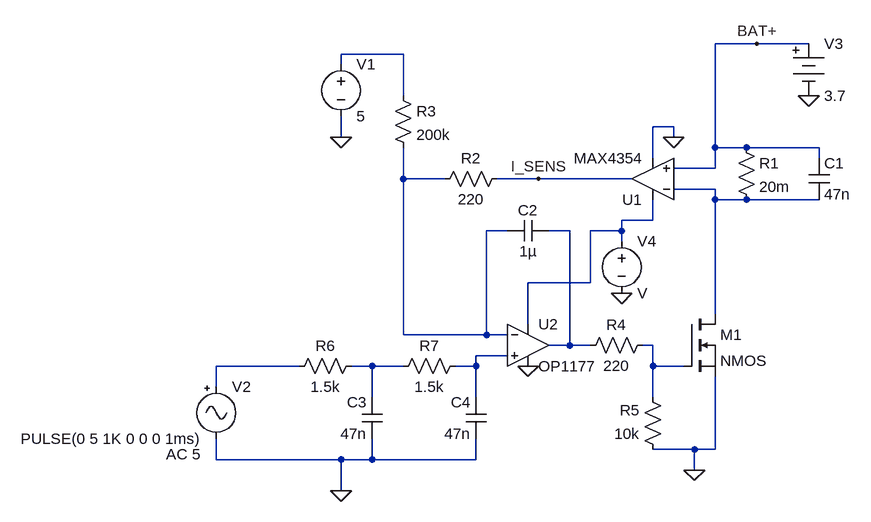
[diagram p0: schematic CurrentSetCircuit.asc]
CurrentSetCircuit.asc, the LTspice schematic file:
Version 4
SHEET 1 880 680
WIRE 208 -32 144 -32
WIRE 288 -32 208 -32
WIRE -336 -16 -432 -16
WIRE -432 0 -432 -16
WIRE -336 48 -336 -16
WIRE 80 96 48 96
WIRE -432 112 -432 80
WIRE 80 112 80 96
WIRE 144 128 144 -32
WIRE 192 128 144 128
WIRE 304 128 192 128
WIRE 48 144 48 96
WIRE 304 144 304 128
WIRE 144 160 144 128
WIRE 144 160 80 160
WIRE -336 176 -336 128
WIRE -272 176 -336 176
WIRE -128 176 -192 176
WIRE 16 176 -128 176
WIRE 144 192 80 192
WIRE 144 208 144 192
WIRE 192 208 144 208
WIRE 304 208 192 208
WIRE 48 240 48 208
WIRE 48 240 0 240
WIRE -176 256 -208 256
WIRE -80 256 -112 256
WIRE 0 256 0 240
WIRE 0 256 -48 256
WIRE 0 272 0 256
WIRE -48 336 -48 256
WIRE -48 336 -144 336
WIRE 144 384 144 208
WIRE -144 400 -144 336
WIRE -336 416 -336 176
WIRE -208 416 -208 256
WIRE -208 416 -336 416
WIRE -176 416 -208 416
WIRE -80 432 -80 256
WIRE -80 432 -112 432
WIRE -48 432 -80 432
WIRE 48 432 32 432
WIRE -176 448 -224 448
WIRE -496 464 -624 464
WIRE -384 464 -416 464
WIRE -336 464 -384 464
WIRE -224 464 -224 448
WIRE -224 464 -256 464
WIRE 48 464 48 432
WIRE 96 464 48 464
WIRE -624 496 -624 464
WIRE -384 512 -384 464
WIRE -224 512 -224 464
WIRE 48 512 48 464
WIRE 112 592 48 592
WIRE 144 592 144 480
WIRE 144 592 112 592
WIRE -624 608 -624 576
WIRE -432 608 -624 608
WIRE -384 608 -384 576
WIRE -384 608 -432 608
WIRE -224 608 -224 576
WIRE -224 608 -384 608
WIRE 112 624 112 592
WIRE -432 656 -432 608
FLAG -432 112 0
FLAG 112 624 0
FLAG -432 656 0
FLAG 288 48 0
FLAG 80 112 0
FLAG -144 464 0
FLAG 0 352 0
FLAG -128 176 I_SENS
FLAG 208 -32 BAT+
SYMBOL res 176 112 R0
SYMATTR InstName R1
SYMATTR Value 20m
SYMBOL cap 288 144 R0
SYMATTR InstName C1
SYMATTR Value 47n
SYMBOL OpAmps\\MAX4354 48 240 R180
SYMATTR InstName U1
SYMBOL res -176 160 R90
WINDOW 0 0 56 VBottom 2
WINDOW 3 32 56 VTop 2
SYMATTR InstName R2
SYMATTR Value 220
SYMBOL res -352 32 R0
SYMATTR InstName R3
SYMATTR Value 200k
SYMBOL nmos 96 384 R0
SYMATTR InstName M1
SYMBOL OpAmps\\OP1177 -144 368 R0
SYMATTR InstName U2
SYMBOL cap -112 240 R90
WINDOW 0 0 32 VBottom 2
WINDOW 3 32 32 VTop 2
SYMATTR InstName C2
SYMATTR Value 1µ
SYMBOL voltage -432 -16 R0
WINDOW 123 0 0 Left 0
WINDOW 39 0 0 Left 0
SYMATTR InstName V1
SYMATTR Value 5
SYMBOL res 48 416 R90
WINDOW 0 0 56 VBottom 2
WINDOW 3 32 56 VTop 2
SYMATTR InstName R4
SYMATTR Value 220
SYMBOL res 64 608 R180
WINDOW 0 36 76 Left 2
WINDOW 3 36 40 Left 2
SYMATTR InstName R5
SYMATTR Value 10k
SYMBOL Misc\\signal -624 480 R0
WINDOW 3 -301 96 Left 2
WINDOW 123 -77 120 Left 2
WINDOW 39 0 0 Left 0
SYMATTR InstName V2
SYMATTR Value PULSE(0 5 1K 0 0 0 1ms)
SYMATTR Value2 AC 5
SYMBOL res -400 448 R90
WINDOW 0 0 56 VBottom 2
WINDOW 3 32 56 VTop 2
SYMATTR InstName R6
SYMATTR Value 1.5k
SYMBOL res -240 448 R90
WINDOW 0 0 56 VBottom 2
WINDOW 3 32 56 VTop 2
SYMATTR InstName R7
SYMATTR Value 1.5k
SYMBOL cap -368 576 R180
WINDOW 0 24 56 Left 2
WINDOW 3 24 8 Left 2
SYMATTR InstName C3
SYMATTR Value 47n
SYMBOL cap -208 576 R180
WINDOW 0 24 56 Left 2
WINDOW 3 24 8 Left 2
SYMATTR InstName C4
SYMATTR Value 47n
SYMBOL Misc\\battery 288 -48 R0
WINDOW 123 0 0 Left 0
WINDOW 39 0 0 Left 0
SYMATTR InstName V3
SYMATTR Value 3.7
SYMBOL voltage 0 256 R0
SYMATTR InstName V4

The netlist it stands for:
* CurrentSetCircuit.asc
R1 BAT+ N003 20m
C1 BAT+ N003 47n
XU1 BAT+ N003 N004 0 I_SENS MAX4354  ; pins In+ In- V+ V- OUT
R2 I_SENS N002 220
R3 N001 N002 200k
M1 N003 N006 0 0 NMOS
XU2 N007 N002 N004 0 N005 OP1177  ; pins In+ In- V+ V- OUT
C2 N005 N002 1µ
V1 N001 0 5
R4 N006 N005 220
R5 0 N006 10k
V2 N008 0 PULSE(0 5 1K 0 0 0 1ms) AC 5
R6 N009 N008 1.5k
R7 N007 N009 1.5k
C3 0 N009 47n
C4 0 N007 47n
V3 BAT+ 0 3.7
V4 N004 0 V
.model NMOS NMOS
.model PMOS PMOS
.lib standard.mos
.lib MAX4354.lib
.lib ADI1.lib
.backanno
.end